# Altium schematic sheet Title.SchDoc
size Letter; SheetNumber: 1; SheetTotal: 11
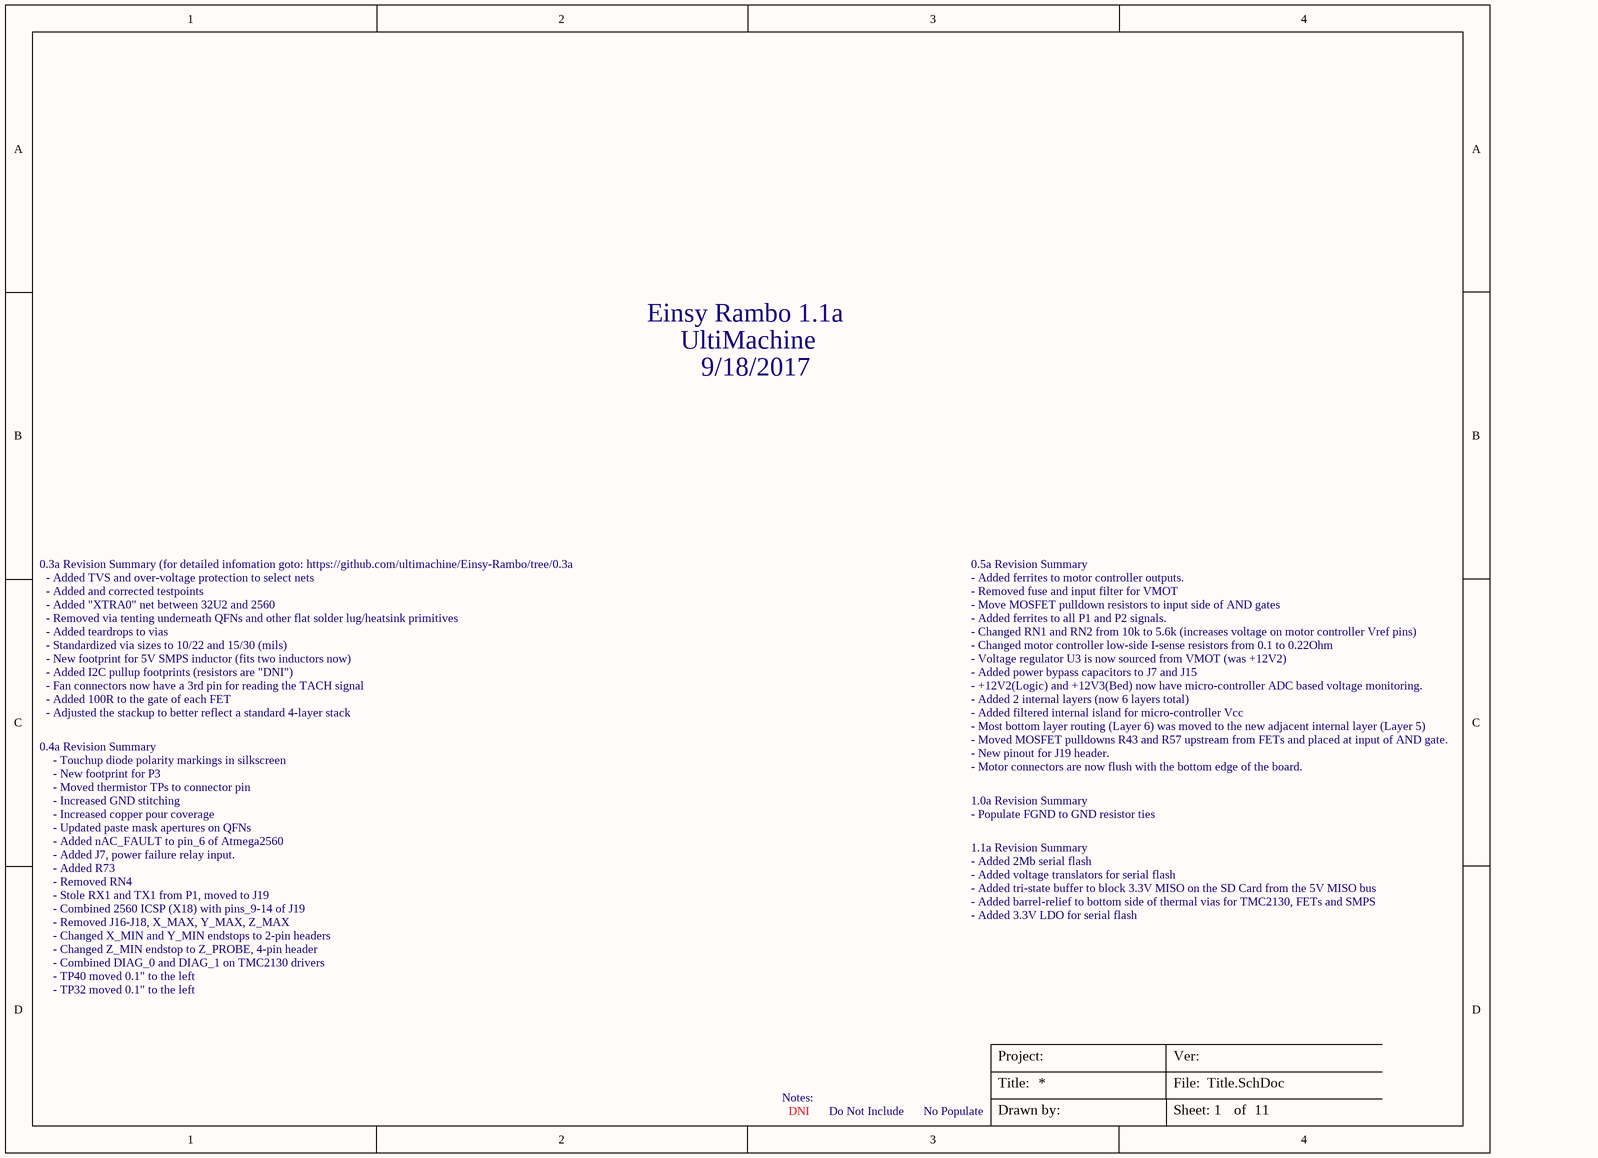
[diagram p0: Title.SchDoc]

## Notes on the sheet
- Einsy Rambo 1.1a
- UltiMachine
- 9/18/2017
- 0.3a Revision Summary (for detailed infomation goto: https://github.com/ultimachine/Einsy-Rambo/tree/0.3a
- 0.5a Revision Summary
- - Added TVS and over-voltage protection to select nets
- - Added and corrected testpoints
- - Added "XTRA0" net between 32U2 and 2560
- - Removed via tenting underneath QFNs and other flat solder lug/heatsink primitives
- - Added teardrops to vias
- - Added ferrites to motor controller outputs.
- - Removed fuse and input filter for VMOT
- - Move MOSFET pulldown resistors to input side of AND gates
- - Added ferrites to all P1 and P2 signals.
- - Changed RN1 and RN2 from 10k to 5.6k (increases voltage on motor controller Vref pins)
- - Standardized via sizes to 10/22 and 15/30 (mils)
- - New footprint for 5V SMPS inductor (fits two inductors now)
- - Added I2C pullup footprints (resistors are "DNI")
- - Fan connectors now have a 3rd pin for reading the TACH signal
- - Added 100R to the gate of each FET
- - Changed motor controller low-side I-sense resistors from 0.1 to 0.22Ohm
- - Voltage regulator U3 is now sourced from VMOT (was +12V2)
- - Added power bypass capacitors to J7 and J15
- - +12V2(Logic) and +12V3(Bed) now have micro-controller ADC based voltage monitoring.
- - Added 2 internal layers (now 6 layers total)
- 0.4a Revision Summary
- - Adjusted the stackup to better reflect a standard 4-layer stack
- - New footprint for P3
- - Touchup diode polarity markings in silkscreen
- - Added filtered internal island for micro-controller Vcc
- - Most bottom layer routing (Layer 6) was moved to the new adjacent internal layer (Layer 5)
- - Moved MOSFET pulldowns R43 and R57 upstream from FETs and placed at input of AND gate.
- - New pinout for J19 header.
- - Motor connectors are now flush with the bottom edge of the board.
- - Updated paste mask apertures on QFNs
- - Increased copper pour coverage
- - Increased GND stitching
- - Moved thermistor TPs to connector pin
- 1.0a Revision Summary
- - Populate FGND to GND resistor ties
- - Removed RN4
- - Added R73
- - Added nAC_FAULT to pin_6 of Atmega2560
- - Combined 2560 ICSP (X18) with pins_9-14 of J19
- - Stole RX1 and TX1 from P1, moved to J19
- - Added J7, power failure relay input.
- 1.1a Revision Summary
- - Added 2Mb serial flash
- - Added voltage translators for serial flash
- - Added tri-state buffer to block 3.3V MISO on the SD Card from the 5V MISO bus
- - Added barrel-relief to bottom side of thermal vias for TMC2130, FETs and SMPS
- - Removed J16-J18, X_MAX, Y_MAX, Z_MAX
- - Changed X_MIN and Y_MIN endstops to 2-pin headers
- - Changed Z_MIN endstop to Z_PROBE, 4-pin header
- - Combined DIAG_0 and DIAG_1 on TMC2130 drivers
- - Added 3.3V LDO for serial flash
- - TP40 moved 0.1" to the left
- - TP32 moved 0.1" to the left
- Notes:
- DNI
- Do Not Include
- No Populate
- Title:
- Project:
- File:
- Ver:
- Drawn by:
- Sheet:
- of